# EAGLE design jewellery (EAGLE 6.1)
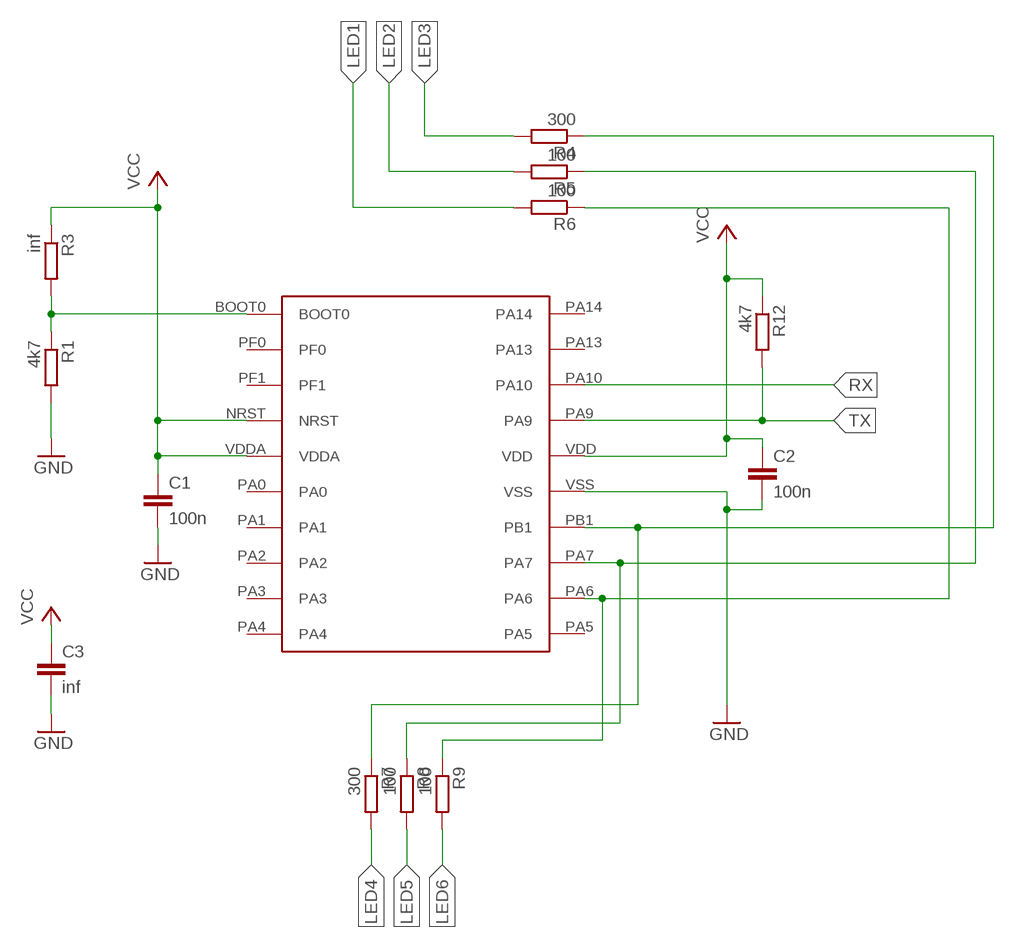
[diagram p0: schematic, sheet 1]

## Parts
C1  100n  C-EUC0805  [C0805]
C2  100n  C-EUC0805  [C0805]
C3  inf  C-EUC0805  [C0805]
R1  4k7  R-EU_R0805  [R0805]
R3  inf  R-EU_R0805  [R0805]
R4  300  R-EU_R0805  [R0805]
R5  100  R-EU_R0805  [R0805]
R6  100  R-EU_R0805  [R0805]
R7  300  R-EU_R0805  [R0805]
R8  100  R-EU_R0805  [R0805]
R9  100  R-EU_R0805  [R0805]
R12  4k7  R-EU_R0805  [R0805]
U$1  STM32F0  [TSSOP20]

## Nets
GND: C1.2 C2.2 C3.2 R1.2 U$1.VSS
LED1: R6.2
LED2: R5.2
LED3: R4.2
LED4: R7.2
LED5: R8.2
LED6: R9.2
N$4: R1.1 R3.2 U$1.BOOT0
N$6: R4.1 R7.1 U$1.PB1
N$8: R5.1 R8.1 U$1.PA7
N$9: R6.1 R9.1 U$1.PA6
RX: U$1.PA10
TX: R12.2 U$1.PA9
VCC: C1.1 C2.1 C3.1 R3.1 R12.1 U$1.NRST U$1.VDD U$1.VDDA
Unconnected: U$1.PA0 U$1.PA1 U$1.PA2 U$1.PA3 U$1.PA4 U$1.PA5 U$1.PA13 U$1.PA14 U$1.PF0 U$1.PF1

## Library data of the parts
C1-C3 = resistor:C-EU: CAPACITOR, European symbol
R1 R3-R9 R12 = resistor:R-EU_: RESISTOR, European symbol
U$1 = kd:STM32F0

## Board
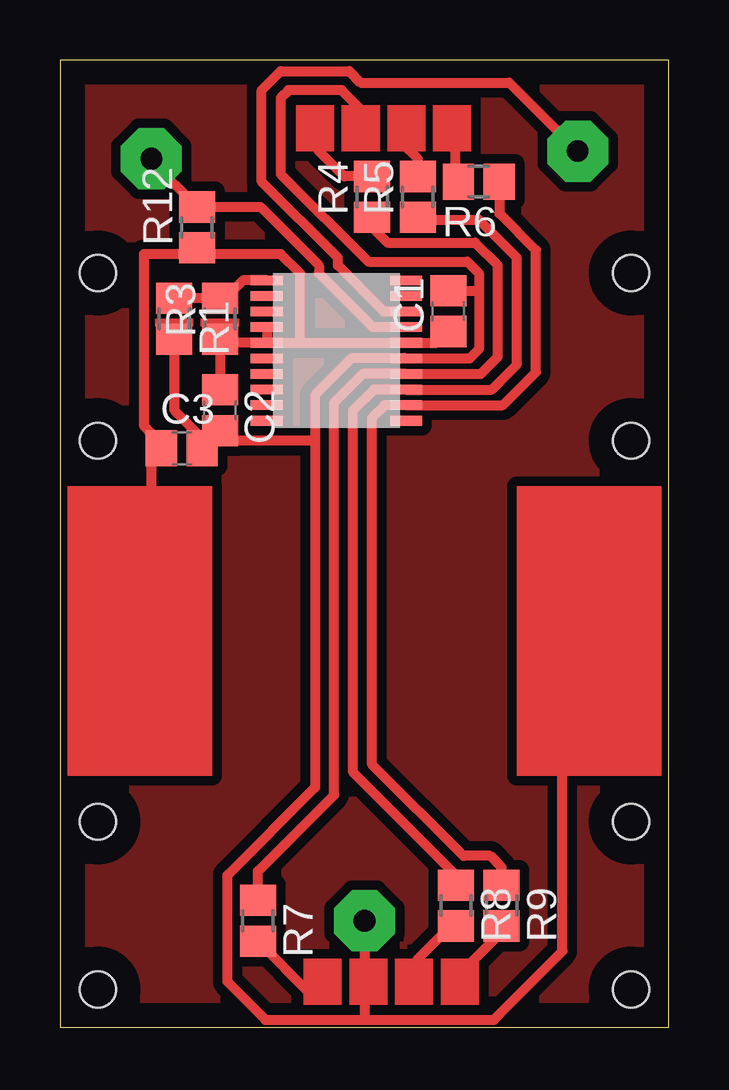
[diagram p1: board, top side]
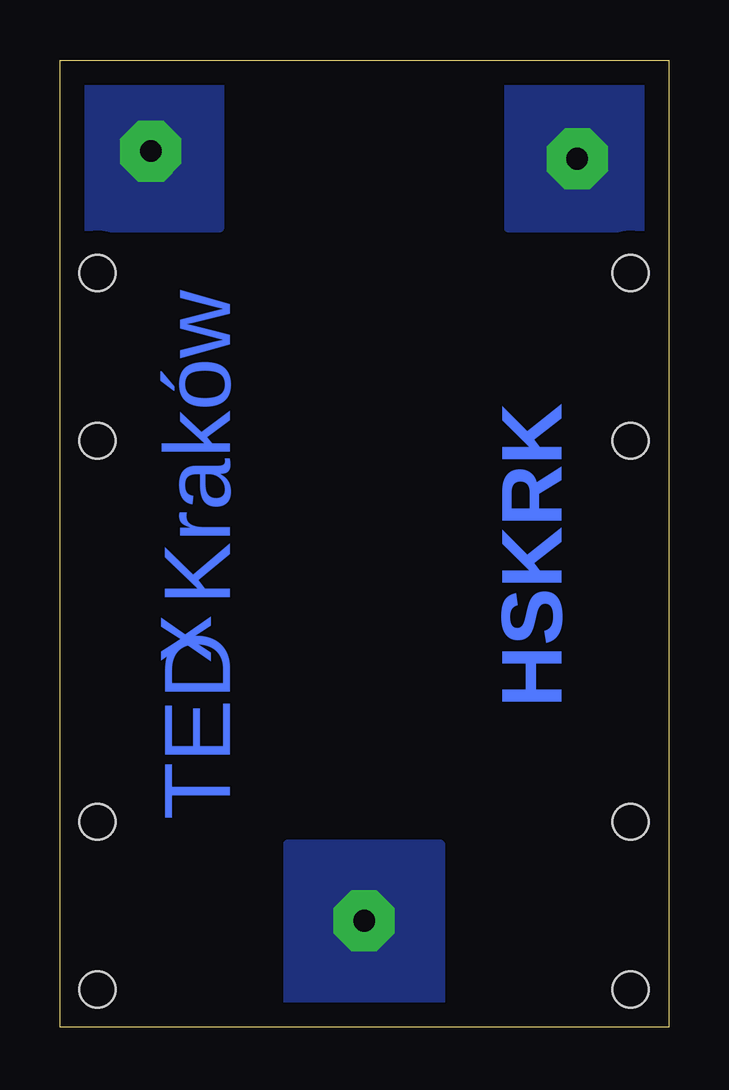
[diagram p2: board, bottom side, seen from below]

Size 25.38 x 40.31 mm. Coordinates in mm from the lower left corner, seen from the top.
Outline: 0,0 25.38,0 25.38,40.31 0,40.31 0,0
Copper layers (1*16): Top 0.035mm / dielectric 1.5mm / Bottom 0.035mm
Design rules: minimum track width 10mil, minimum drill 24mil, track to track 8mil, track to pad 8mil, pad to pad 8mil, via to via 8mil, smd to smd 8mil, copper to edge 40mil, drill to drill 8mil, minimum pad ring 10mil, minimum via ring 8mil, stop-mask expansion 4mil, vias tented up to drill 0mil, thermal gap 10mil
Holes 1.5 mm at 1.59,24.45 1.59,31.43 1.59,8.57 1.59,1.59 23.81,1.59 23.81,8.57 23.81,24.45 23.81,31.43

### Footprints (pad centres in the part's own frame; a part is rotated, then mirrored left to right if it is on the bottom)
C0805 = smd 1.3 x 1.5: 1 -0.85,0; 2 0.85,0
R0805 = smd 1.3 x 1.5: 1 -0.85,0; 2 0.85,0
TSSOP20 = smd 1.35 x 0.4: BOOT0 -0.9,0.65; NRST -0.9,-1.3; PA0 -0.9,-2.6; PA1 -0.9,-3.25; PA2 -0.9,-3.9; PA3 -0.9,-4.55; PA4 -0.9,-5.2; PA5 4.9,-5.2; PA6 4.9,-4.55; PA7 4.9,-3.9; PA9 4.9,-1.3; PA10 4.9,-0.65; PA13 4.9,0; PA14 4.9,0.65; PB1 4.9,-3.25; PF0 -0.9,0; PF1 -0.9,-0.65; VDD 4.9,-1.95; VDDA -0.9,-1.95; VSS 4.9,-2.6

### Placement (x,y rotation side)
C1  16.19,29.84 90 top
C2  6.67,25.72 270 top
C3  5.08,24.13 0 top
R1  4.76,29.53 270 top
R3  6.67,29.53 90 top
R4  13.02,34.61 90 top
R5  14.92,34.61 90 top
R6  17.46,35.24 180 top
R7  8.26,4.45 270 top
R8  16.51,5.08 270 top
R9  18.41,5.08 270 top
R12  5.71,33.34 90 top
U$1  9.53,30.48 0 top

### Tracks (layer width: path | path; a pad name or v marks a point on that pad's centre or on a via)
GND  (via drill 0.9 pad 2.54)
  Top 0.406: 17.46,30.8 17.46,31.43 16.99,31.91 12.86,31.91 9.21,35.56 9.21,38.73 9.53,39.05 11.75,39.05 13.02,37.78 12.7,37.47 | 17.46,30.8 17.46,28.26 17.09,27.88 U$1.VSS 12.16,27.88 10.64,26.35 10.64,24.45 | 12.7,0.32 8.57,0.32 6.99,1.91 6.99,6.35 10.64,10 10.64,24.45 | 5.93,24.55 4.76,25.72 R1.2 | 10.64,24.45 6.67,24.45 C2.2 6.35,24.55 5.93,24.55 | v12.7,4.45 12.7,0.32 | C1.2 17.36,30.7 17.46,30.8 | 12.7,0.32 18.1,0.32 20.95,3.17 20.95,11.11 | C3.2 5.93,24.55
  pour Bottom: 9.53,7.62 15.88,7.62 15.88,0.95 9.53,0.95
LED1
  Top 0.406: R6.2 16.49,35.48 16.49,37.17 16.19,37.47
LED2
  Top 0.406: 14.29,37.47 14.29,36.83 14.92,36.2 R5.2
LED3
  Top 0.406: 10.48,37.47 10.79,37.15 10.79,36.51 11.85,35.46 R4.2
LED4
  Top 0.406: R7.2 10.48,1.37 10.48,2.22 10.79,1.59
LED5
  Top 0.406: 14.92,2.54 14.92,2.86 16.51,4.45 R8.2
LED6
  Top 0.406: R9.2 18.41,3.97 16.75,2.3 16.75,1.98 16.83,1.91
N$4
  Top 0.406: U$1.BOOT0 7.63,31.13 6.67,30.16 R3.2 R1.1
N$6
  Top 0.406: R7.1 8.26,6.51 11.43,9.68 11.43,26.04 12.62,27.23 U$1.PB1 17.55,27.23 18.26,27.94 18.26,31.75 17.3,32.7 13.65,32.7 12.7,33.66 13.02,33.66 R4.1
N$8
  Top 0.406: R5.1 14.45,33.66 17.46,33.66 19.05,32.07 19.05,27.62 18.01,26.58 U$1.PA7 13.09,26.58 12.22,25.72 12.22,10.64 16.45,6.41 R8.1
N$9
  Top 0.406: R9.1 18.41,6.67 17.94,7.14 16.83,7.14 13.02,10.95 13.02,25.4 13.55,25.93 U$1.PA6 18.47,25.93 19.84,27.3 19.84,32.38 18.31,33.92 R6.1
N$14
  pour Top (isolate 0.406): 0.32,40.01 25.08,40.01 25.08,0.32 0.32,0.32
RX  (via drill 0.9 pad 2.54)
  Top 0.406: U$1.PA10 13.51,29.83 11.59,31.75 11.59,32.07 8.41,35.24 8.41,39.05 9.21,39.85 12.06,39.85 12.54,39.37 18.73,39.37 v21.59,36.51
  pour Bottom: 18.73,40.01 25.08,40.01 25.08,33.34 18.73,33.34
TX  (via drill 0.9 pad 2.54)
  Top 0.406: U$1.PA9 13.05,29.18 10.79,31.43 10.79,31.75 8.36,34.19 R12.2 3.81,36.09 v3.81,36.2
  pour Bottom: 0.32,40.01 6.67,40.01 6.67,33.34 0.32,33.34
VCC
  Top 0.406: U$1.VDDA 10.02,28.53 | 10.02,28.53 U$1.VDD 15.73,28.53 C1.1 | 10.02,28.53 10.02,31.42 9.21,32.23 5.71,32.23 | 5.71,32.23 3.49,32.23 3.49,25.08 3.81,24.77 3.81,24.13 | 3.81,24.13 3.81,15.56 | C3.1 3.81,24.13 | U$1.NRST U$1.VDDA | U$1.VDDA 7.1,28.53 6.67,28.73 | 6.67,28.73 C2.1 | R3.1 6.57,28.68 6.67,28.73 | R12.1 5.71,32.23
(copper drawn outside any net)
  shapes: Top area x12

### Text on the board
Bottom: HSKRK | TED Kraków | x